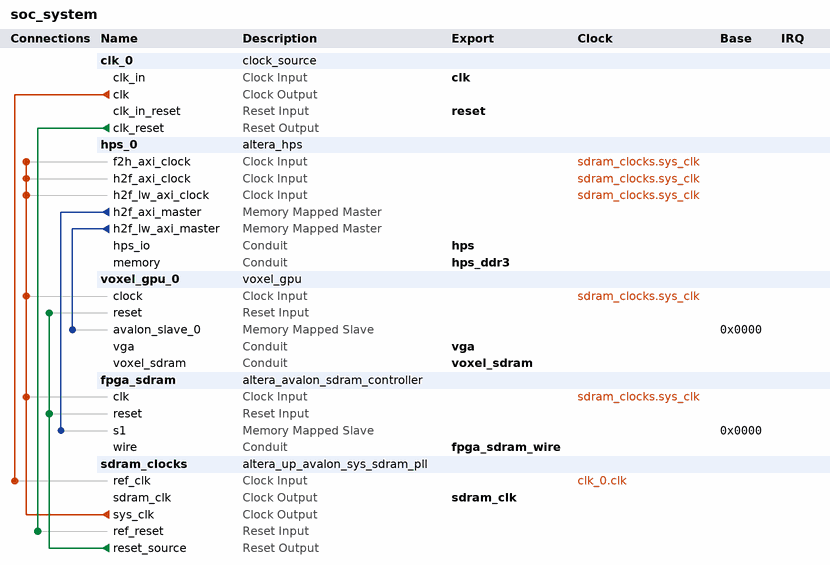
[diagram p0: system contents]
# Platform Designer (Qsys) system soc_system, Cyclone V 5CSEMA5F31C6
# Parameters at their usual value, and those the tool derives, are not listed.
package require -exact qsys 19.1
create_system soc_system
set_project_property DEVICE_FAMILY {Cyclone V}
set_project_property DEVICE 5CSEMA5F31C6

add_instance clk_0 clock_source 19.1
set_instance_parameter_value clk_0 clockFrequency 50000000

add_instance hps_0 altera_hps 19.1
set_instance_parameter_value hps_0 EMAC1_Mode RGMII
set_instance_parameter_value hps_0 EMAC1_PinMuxing {HPS I/O Set 0}
set_instance_parameter_value hps_0 F2SCLK_COLDRST_Enable false
set_instance_parameter_value hps_0 F2SCLK_DBGRST_Enable false
set_instance_parameter_value hps_0 F2SCLK_WARMRST_Enable false
set_instance_parameter_value hps_0 F2SINTERRUPT_Enable false
set_instance_parameter_value hps_0 F2S_Width 2
set_instance_parameter_value hps_0 FPGA_PERIPHERAL_OUTPUT_CLOCK_FREQ_EMAC0_GTX_CLK 125
set_instance_parameter_value hps_0 FPGA_PERIPHERAL_OUTPUT_CLOCK_FREQ_EMAC0_MD_CLK 2.5
set_instance_parameter_value hps_0 FPGA_PERIPHERAL_OUTPUT_CLOCK_FREQ_EMAC1_GTX_CLK 125
set_instance_parameter_value hps_0 FPGA_PERIPHERAL_OUTPUT_CLOCK_FREQ_EMAC1_MD_CLK 2.5
set_instance_parameter_value hps_0 HPS_PROTOCOL DDR3
set_instance_parameter_value hps_0 I2C0_Mode I2C
set_instance_parameter_value hps_0 I2C0_PinMuxing {HPS I/O Set 0}
set_instance_parameter_value hps_0 I2C1_Mode I2C
set_instance_parameter_value hps_0 I2C1_PinMuxing {HPS I/O Set 0}
set_instance_parameter_value hps_0 LWH2F_Enable true
set_instance_parameter_value hps_0 MEM_BANKADDR_WIDTH 3
set_instance_parameter_value hps_0 MEM_CLK_FREQ 400.0
set_instance_parameter_value hps_0 MEM_COL_ADDR_WIDTH 10
set_instance_parameter_value hps_0 MEM_DQ_WIDTH 32
set_instance_parameter_value hps_0 MEM_DRV_STR RZQ/7
set_instance_parameter_value hps_0 MEM_ROW_ADDR_WIDTH 15
set_instance_parameter_value hps_0 MEM_RTT_NOM RZQ/4
set_instance_parameter_value hps_0 MEM_RTT_WR RZQ/4
set_instance_parameter_value hps_0 MEM_TCL 11
set_instance_parameter_value hps_0 MEM_TFAW_NS 30.0
set_instance_parameter_value hps_0 MEM_TRAS_NS 35.0
set_instance_parameter_value hps_0 MEM_TRCD_NS 13.75
set_instance_parameter_value hps_0 MEM_TRFC_NS 260.0
set_instance_parameter_value hps_0 MEM_TRP_NS 13.75
set_instance_parameter_value hps_0 MEM_TRRD_NS 7.7
set_instance_parameter_value hps_0 MEM_VENDOR JEDEC
set_instance_parameter_value hps_0 MEM_WTCL 8
set_instance_parameter_value hps_0 QSPI_Mode N/A
set_instance_parameter_value hps_0 QSPI_PinMuxing Unused
set_instance_parameter_value hps_0 REF_CLK_FREQ 25.0
set_instance_parameter_value hps_0 S2FCLK_USER1CLK_Enable true
set_instance_parameter_value hps_0 S2FCLK_USER2CLK 5
set_instance_parameter_value hps_0 S2F_Width 2
set_instance_parameter_value hps_0 SDIO_Mode {4-bit Data}
set_instance_parameter_value hps_0 SDIO_PinMuxing {HPS I/O Set 0}
set_instance_parameter_value hps_0 SPIM1_Mode {Single Slave Select}
set_instance_parameter_value hps_0 SPIM1_PinMuxing {HPS I/O Set 0}
set_instance_parameter_value hps_0 STM_Enable false
set_instance_parameter_value hps_0 TIMING_BOARD_AC_SKEW 0.03
set_instance_parameter_value hps_0 TIMING_BOARD_AC_TO_CK_SKEW 0.0
set_instance_parameter_value hps_0 TIMING_BOARD_DQ_TO_DQS_SKEW 0.0
set_instance_parameter_value hps_0 TIMING_BOARD_MAX_CK_DELAY 0.03
set_instance_parameter_value hps_0 TIMING_BOARD_MAX_DQS_DELAY 0.02
set_instance_parameter_value hps_0 TIMING_BOARD_SKEW_BETWEEN_DQS 0.08
set_instance_parameter_value hps_0 TIMING_BOARD_SKEW_CKDQS_DIMM_MAX 0.16
set_instance_parameter_value hps_0 TIMING_BOARD_SKEW_CKDQS_DIMM_MIN 0.09
set_instance_parameter_value hps_0 TIMING_BOARD_SKEW_WITHIN_DQS 0.01
set_instance_parameter_value hps_0 TIMING_TDH 65
set_instance_parameter_value hps_0 TIMING_TDQSCK 255
set_instance_parameter_value hps_0 TIMING_TDQSQ 125
set_instance_parameter_value hps_0 TIMING_TDS 30
set_instance_parameter_value hps_0 TIMING_TIH 140
set_instance_parameter_value hps_0 TIMING_TIS 180
set_instance_parameter_value hps_0 TIMING_TQSH 0.4
set_instance_parameter_value hps_0 UART0_Mode {No Flow Control}
set_instance_parameter_value hps_0 UART0_PinMuxing {HPS I/O Set 0}
set_instance_parameter_value hps_0 USB1_Mode SDR
set_instance_parameter_value hps_0 USB1_PinMuxing {HPS I/O Set 0}
set_instance_parameter_value hps_0 desired_cfg_clk_mhz 97.368421
set_instance_parameter_value hps_0 desired_qspi_clk_mhz 400.0

add_instance voxel_gpu_0 voxel_gpu 1.0

add_instance fpga_sdram altera_avalon_sdram_controller 19.1
set_instance_parameter_value fpga_sdram TAC 5.4
set_instance_parameter_value fpga_sdram TMRD 3
set_instance_parameter_value fpga_sdram TRCD 15.0
set_instance_parameter_value fpga_sdram TRFC 70.0
set_instance_parameter_value fpga_sdram TRP 15.0
set_instance_parameter_value fpga_sdram TWR 14.0
set_instance_parameter_value fpga_sdram casLatency 3
set_instance_parameter_value fpga_sdram columnWidth 10
set_instance_parameter_value fpga_sdram dataWidth 16
set_instance_parameter_value fpga_sdram generateSimulationModel false
set_instance_parameter_value fpga_sdram initNOPDelay 0.0
set_instance_parameter_value fpga_sdram initRefreshCommands 2
set_instance_parameter_value fpga_sdram masteredTristateBridgeSlave 0
set_instance_parameter_value fpga_sdram model single_Micron_MT48LC4M32B2_7_chip
set_instance_parameter_value fpga_sdram numberOfBanks 4
set_instance_parameter_value fpga_sdram numberOfChipSelects 1
set_instance_parameter_value fpga_sdram pinsSharedViaTriState false
set_instance_parameter_value fpga_sdram powerUpDelay 100.0
set_instance_parameter_value fpga_sdram refreshPeriod 7.8125
set_instance_parameter_value fpga_sdram registerDataIn true
set_instance_parameter_value fpga_sdram rowWidth 13

add_instance sdram_clocks altera_up_avalon_sys_sdram_pll 18.0
set_instance_parameter_value sdram_clocks CV_boards DE1-SoC
set_instance_parameter_value sdram_clocks gui_outclk 50.0
set_instance_parameter_value sdram_clocks gui_refclk 50.0

# connections
add_connection clk_0.clk sdram_clocks.ref_clk clock
add_connection sdram_clocks.sys_clk fpga_sdram.clk clock
add_connection sdram_clocks.sys_clk hps_0.f2h_axi_clock clock
add_connection sdram_clocks.sys_clk hps_0.h2f_axi_clock clock
add_connection sdram_clocks.sys_clk hps_0.h2f_lw_axi_clock clock
add_connection sdram_clocks.sys_clk voxel_gpu_0.clock clock
add_connection clk_0.clk_reset sdram_clocks.ref_reset reset
add_connection sdram_clocks.reset_source fpga_sdram.reset reset
add_connection sdram_clocks.reset_source voxel_gpu_0.reset reset
add_connection hps_0.h2f_axi_master fpga_sdram.s1 avalon
set_connection_parameter_value hps_0.h2f_axi_master/fpga_sdram.s1 baseAddress 0x0000
add_connection hps_0.h2f_lw_axi_master voxel_gpu_0.avalon_slave_0 avalon
set_connection_parameter_value hps_0.h2f_lw_axi_master/voxel_gpu_0.avalon_slave_0 baseAddress 0x0000

# exported interfaces
add_interface clk clock sink
set_interface_property clk EXPORT_OF clk_0.clk_in
add_interface fpga_sdram_wire conduit end
set_interface_property fpga_sdram_wire EXPORT_OF fpga_sdram.wire
add_interface hps conduit end
set_interface_property hps EXPORT_OF hps_0.hps_io
add_interface hps_ddr3 conduit end
set_interface_property hps_ddr3 EXPORT_OF hps_0.memory
add_interface reset reset sink
set_interface_property reset EXPORT_OF clk_0.clk_in_reset
add_interface sdram_clk clock source
set_interface_property sdram_clk EXPORT_OF sdram_clocks.sdram_clk
add_interface voxel_sdram conduit end
set_interface_property voxel_sdram EXPORT_OF voxel_gpu_0.voxel_sdram
add_interface vga conduit end
set_interface_property vga EXPORT_OF voxel_gpu_0.vga

set_interconnect_requirement {$system} qsys_mm.clockCrossingAdapter HANDSHAKE
set_interconnect_requirement {$system} qsys_mm.enableEccProtection FALSE
set_interconnect_requirement {$system} qsys_mm.insertDefaultSlave FALSE
set_interconnect_requirement {$system} qsys_mm.maxAdditionalLatency 1

save_system soc_system.qsys
